# EAGLE design charger (EAGLE 7.5.0)
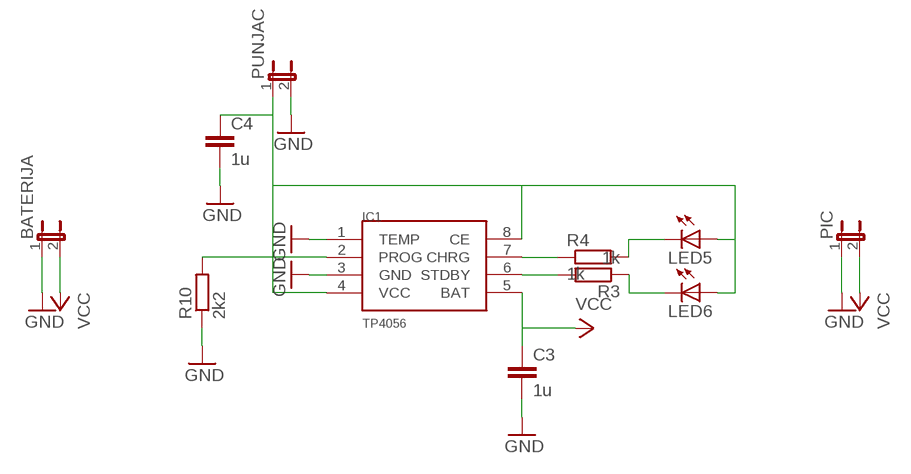
[diagram p0: schematic, sheet 1]

## Parts
BATERIJA  JP1E  [JP1]
C3  1u  C-EU050-024X044  [C050-024X044]
C4  1u  C-EU050-024X044  [C050-024X044]
IC1  TP4056  [SOP-8]
LED5  LED3MM  [LED3MM]
LED6  LED3MM  [LED3MM]
PIC  JP1E  [JP1]
PUNJAC  JP1E  [JP1]
R3  1k  R-EU_0207/10  [0207/10]
R4  1k  R-EU_0207/10  [0207/10]
R10  2k2  R-EU_0207/10  [0207/10]

## Nets
GND: BATERIJA.1 C3.2 C4.2 IC1.1(TEMP) IC1.3(GND) PIC.1 PUNJAC.2 R10.1
N$18: IC1.7(CHRG) R4.1
N$23: IC1.6(STDBY) R3.2
N$24: LED5.K(C) R4.2
N$25: LED6.K(C) R3.1
N$26: IC1.2(PROG) R10.2
N$27: C4.1 IC1.4(VCC) IC1.8(CE) LED5.A LED6.A PUNJAC.1
VCC: BATERIJA.2 C3.1 IC1.5(BAT) PIC.2

## Library data of the parts
BATERIJA PIC PUNJAC = jumper:JP1E: JUMPER
C3 C4 = rcl:C-EU: CAPACITOR, European symbol
IC1 = TP4056:TP4056
LED5 LED6 = led:LED: LED OSRAM: - CHIPLED LG R971, LG N971, LY N971, LG Q971, LY Q971, LO R971, LY R971 LH N974, LH R974 LS Q976, LO Q976, LY Q976 LO Q996 - Hyper CHIPLED LW Q18S LB Q993, LB Q99A, LB R99A - SideLED LS A670, LO A670, LY A670, LG A670, LP A670 LB A673, LV A673, LT A673, LW A673 LH A674 LY A675 LS A676, LA A676, LO A676, LY A676, LW A676 LS A679, LY A679, LG A679 - Hyper Micro SIDELED® LS Y876, LA Y876, LO Y876, LY Y876 LT Y87S - SmartLED LW L88C, LW L88S LB L89C, LB L89S, LG L890 LS L89K, LO L89K, LY L89K LS L896, LA L896, LO L896, LY L896 - TOPLED LS T670, LO T670, LY T670, LG T670, LP T670 LSG T670, LSP T670, LSY T670, LOP T670, LYG T670 LG T671, LOG T671, LSG T671 LB T673, LV T673, LT T673, LW T673 LH T674 LS T676, LA T676, LO T676, LY T676, LB T676, LH T676, LSB T676, LW T676 LB T67C, LV T67C, LT T67C, LS T67K, LO T67K, LY T67K, LW E67C LS E67B, LA E67B, LO E67B, LY E67B, LB E67C, LV E67C, LT E67C LW T67C LS T679, LY T679, LG T679 LS T770, LO T770, LY T770, LG T770, LP T770 LB T773, LV T773, LT T773, LW T773 LH T774 LS E675, LA E675, LY E675, LS T675 LS T776, LA T776, LO T776, LY T776, LB T776 LHGB T686 LT T68C, LB T68C - Hyper Mini TOPLED® LB M676 - Mini TOPLED Santana® LG M470 LS M47K, LO M47K, LY M47K Source: http://www.osram.convergy.de LUXEON: - LUMILED® LXK2-PW12-R00, LXK2-PW12-S00, LXK2-PW14-U00, LXK2-PW14-V00 LXK2-PM12-R00, LXK2-PM12-S00, LXK2-PM14-U00 LXK2-PE12-Q00, LXK2-PE12-R00, LXK2-PE12-S00, LXK2-PE14-T00, LXK2-PE14-U00 LXK2-PB12-K00, LXK2-PB12-L00, LXK2-PB12-M00, LXK2-PB14-N00, LXK2-PB14-P00, LXK2-PB14-Q00 LXK2-PR12-L00, LXK2-PR12-M00, LXK2-PR14-Q00, LXK2-PR14-R00 LXK2-PD12-Q00, LXK2-PD12-R00, LXK2-PD12-S00 LXK2-PH12-R00, LXK2-PH12-S00 LXK2-PL12-P00, LXK2-PL12-Q00, LXK2-PL12-R00 Source: www.luxeon.com KINGBRIGHT: KA-3528ASYC Source: www.kingbright.com
R3 R4 R10 = rcl:R-EU_: RESISTOR, European symbol

## Board
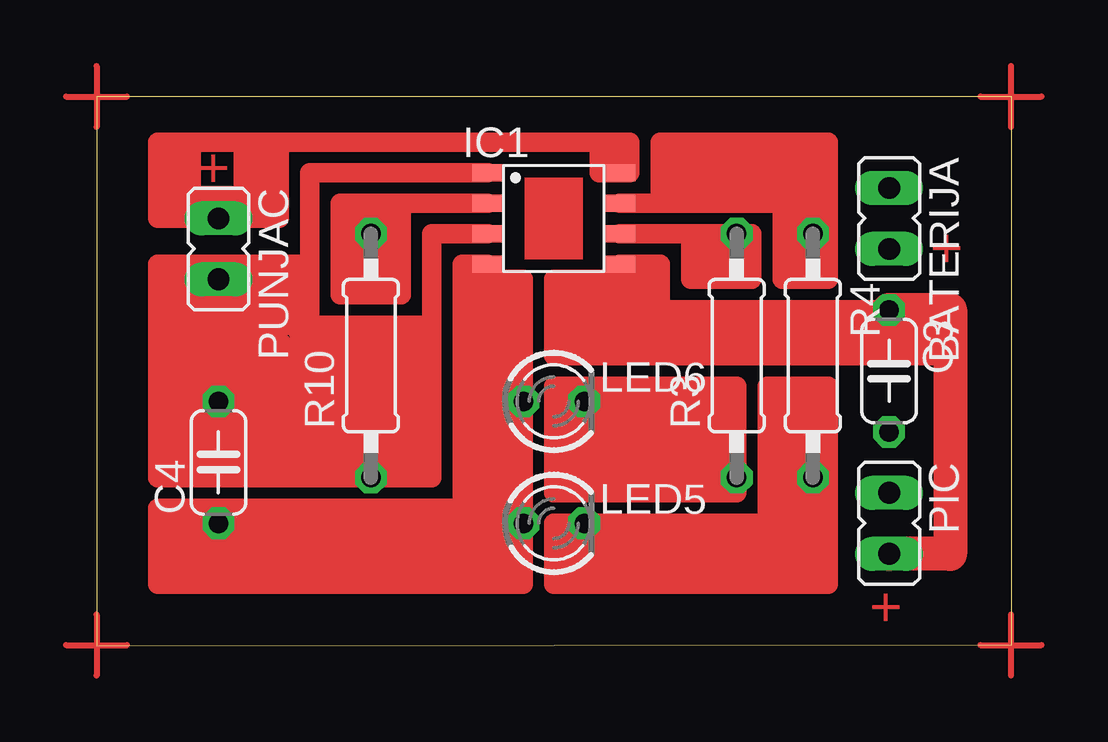
[diagram p1: board, top side]
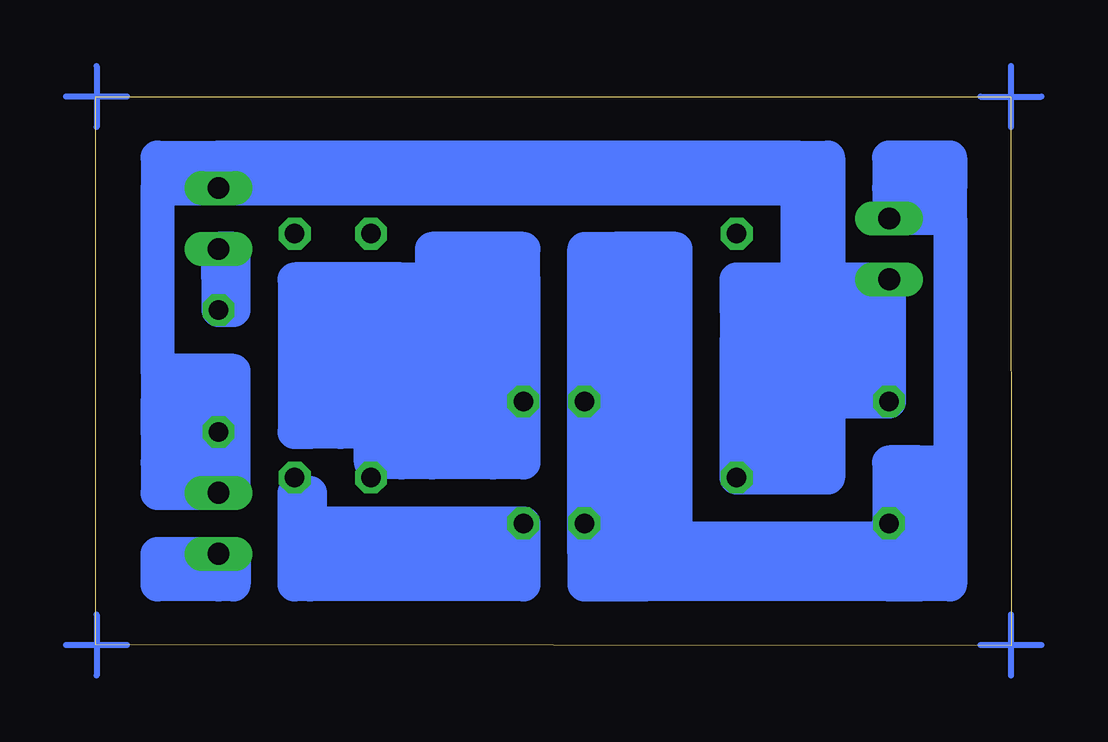
[diagram p2: board, bottom side, seen from below]

Size 38.13 x 22.88 mm. Coordinates in mm from the lower left corner, seen from the top.
Outline: 0,0 38.13,0.03 38.13,22.88 0,22.87 0,0
Copper layers (1*16): Top 0.035mm / dielectric 1.5mm / Bottom 0.035mm
Design rules "default": minimum track width 10mil, minimum drill 24mil, track to track 8mil, track to pad 8mil, pad to pad 8mil, via to via 8mil, smd to smd 8mil, copper to edge 40mil, drill to drill 8mil, minimum pad ring 10mil, minimum via ring 8mil, stop-mask expansion 4mil, vias tented up to drill 0mil, thermal gap 10mil

### Footprints (pad centres in the part's own frame; a part is rotated, then mirrored left to right if it is on the bottom)
JP1 = drill 0.914 long: 1 0,-1.27; 2 0,1.27
C050-024X044 = drill 0.813 octagon: 1 -2.54,0; 2 2.54,0
SOP-8 = smd 1.3 x 0.7: 1 -2.75,1.905; 2 -2.75,0.635; 3 -2.75,-0.635; 4 -2.75,-1.905; 5 2.75,-1.905; 6 2.75,-0.635; 7 2.75,0.635; 8 2.75,1.905
LED3MM = drill 0.813 octagon: A -1.27,0; K 1.27,0
0207/10 = drill 0.813 octagon: 1 -5.08,0; 2 5.08,0

### Placement (x,y rotation side)
BATERIJA  33.02,17.8 180 top
C3  33.02,11.45 270 top
C4  5.08,7.64 90 top
IC1  19.05,17.8 0 top
LED5  19.05,5.1 0 top
LED6  19.05,10.18 0 top
PIC  33.02,5.1 180 top
PUNJAC  5.08,16.53 180 top
R3  26.67,12.08 90 top
R4  29.85,12.08 270 top
R10  11.43,12.08 90 top

### Tracks (layer width: path | path; a pad name or v marks a point on that pad's centre or on a via)
GND
  Top 0.813: IC1.3 13.97,17.16 13.97,13.35 | IC1.1 8.89,19.7 8.89,15.89 | 8.89,15.89 3.81,15.89 | 4.45,14.62 8.89,14.62 | 8.89,14.62 8.89,15.89 | 8.89,15.89 8.26,15.26 PUNJAC.2 4.45,15.26 | 13.97,13.35 8.89,13.35 | 8.89,13.35 8.89,13.99 | 8.89,13.99 8.89,14.62 | 13.97,7.64 13.97,7 | 13.97,7 R10.1 | R10.1 5.72,7 | 5.72,7 4.45,7 | 4.45,14.62 4.45,13.99 | 4.45,7 4.45,7.64 | 4.45,7.64 5.72,7.64 | 5.72,7.64 13.34,7.64 | 13.34,7.64 13.97,7.64 | 13.97,7.64 13.97,8.27 | 13.97,8.27 13.97,12.72 | 13.97,13.35 13.97,12.72 | 13.97,12.72 8.89,12.72 8.89,13.35 | 8.89,13.99 4.45,13.99 | 4.45,7.64 13.97,8.27 | 13.97,8.27 13.34,12.08 10.16,12.08 | 8.89,12.08 8.26,13.35 5.08,13.35 5.08,12.72 | 5.08,12.72 5.08,12.08 | 5.08,11.45 C4.2 5.08,8.27 5.72,8.27 | 12.7,8.27 13.34,8.27 13.34,11.45 12.7,11.45 | 12.7,11.45 12.07,11.45 | 11.43,11.45 10.8,11.45 | 10.16,11.45 9.53,11.45 | 9.53,11.45 8.89,11.45 | 8.89,11.45 7.62,12.72 5.08,12.72 | 5.08,12.72 5.72,8.27 | 5.72,8.27 6.35,8.27 | 6.35,8.27 6.99,8.27 | 7.62,8.27 8.26,8.27 | 8.89,8.27 9.53,8.27 | 10.16,8.27 10.8,8.27 | 11.43,8.27 12.07,8.27 | 12.07,8.27 12.7,8.27 | 12.7,8.27 12.7,11.45 | 8.89,11.45 8.26,11.45 | 8.26,11.45 5.08,11.45 | 5.08,11.45 5.08,12.08 | 5.08,12.08 5.72,12.08 | 5.72,12.08 6.35,12.08 | 6.99,12.08 7.62,12.08 | 7.62,12.08 8.89,12.08 | 5.72,12.08 5.72,7.64 | 5.72,7.64 6.35,8.27 | 6.35,8.27 6.35,12.08 | 6.35,12.08 6.99,12.08 | 6.99,12.08 6.99,8.27 | 6.99,8.27 7.62,8.27 | 7.62,8.27 7.62,12.08 | 7.62,12.08 8.26,11.45 | 8.26,11.45 8.26,8.27 | 8.26,8.27 8.89,8.27 | 8.89,8.27 8.89,12.08 | 8.89,12.08 10.16,12.08 | 10.16,12.08 9.53,11.45 | 9.53,11.45 9.53,8.27 | 9.53,8.27 10.16,8.27 | 10.16,8.27 10.16,11.45 | 10.16,11.45 10.8,11.45 | 10.8,11.45 10.8,8.27
  Top 0.813: 10.8,8.27 11.43,8.27 | 11.43,8.27 11.43,11.45 | 11.43,11.45 12.07,11.45 | 12.07,11.45 12.07,8.27 | 12.07,8.27 13.34,7.64 | 13.34,7.64 13.97,7 | R10.1 11.43,8.27 | 3.81,14.62 3.81,15.89 | 3.18,15.89 2.54,15.89 2.54,7 3.18,7 | 5.72,7 5.72,7.64 | 4.45,7.64 3.81,7.64 | 3.81,7.64 3.81,14.62 | 3.81,14.62 4.45,14.62 | 4.45,13.99 4.45,7.64 | 4.45,7 3.81,7 | 3.81,7 3.18,7 | 3.18,7 3.18,15.89 | 3.18,15.89 3.81,15.89 | 3.81,7.64 3.81,7
  Bottom 1.422: 8.89,15.26 7.62,15.26 | 33.02,20.34 BATERIJA.1 | BATERIJA.1 8.89,19.07 | 8.89,20.34 33.02,20.34 | 35.56,19.07 35.56,20.34 33.02,20.34 | 35.56,19.07 BATERIJA.1 | 8.89,19.07 8.89,20.34 | 8.89,20.34 7.62,20.34 7.62,19.07 | 7.62,19.07 7.62,16.53 | 7.62,16.53 8.89,16.53 | 8.89,16.53 8.89,19.07 | 8.89,19.07 7.62,19.07 | 7.62,16.53 7.62,15.26 | 7.62,10.18 7.62,7 8.89,7 | 10.16,7 R10.1 11.43,10.18 | 11.43,11.45 11.43,12.72 | 11.43,13.99 11.43,15.26 8.89,15.26 | 8.89,15.26 8.89,16.53 | 7.62,12.72 7.62,10.18 | 7.62,10.18 C4.2 | C4.2 5.08,11.45 | 5.08,12.72 5.08,13.99 | 5.08,13.99 11.43,13.99 | 11.43,13.99 11.43,12.72 | 11.43,12.72 7.62,12.72 | 10.16,10.18 8.89,10.18 | C4.2 8.89,10.18 | 8.89,10.18 8.89,7 | 8.89,7 10.16,7 | 10.16,7 10.16,10.18 | 10.16,10.18 11.43,10.18 | 11.43,10.18 11.43,11.45 | 11.43,11.45 5.08,11.45 | 5.08,11.45 5.08,12.72 | 5.08,12.72 7.62,12.72 | 7.62,12.72 7.62,15.26 | 7.62,15.26 PUNJAC.2 5.08,13.99 | PIC.1 32.39,6.37 32.39,11.45 33.02,11.45 | 33.02,7.64 C3.2 | 34.29,8.91 35.56,8.91 | 35.56,8.91 35.56,10.18 | 35.56,11.45 35.56,19.07 | 35.56,8.91 35.56,7.64 | 35.56,7.64 35.56,6.37 PIC.1 | PIC.1 33.02,7.64 | 35.56,7.64 33.02,7.64 | 33.02,10.18 33.02,11.45 | 33.02,11.45 35.56,11.45 | 35.56,11.45 35.56,10.18 | 35.56,10.18 34.29,10.18 | 34.29,8.91 34.29,10.18 | 34.29,10.18 33.02,10.18 | 33.02,10.18 C3.2 | 34.29,8.91 C3.2
N$1
  Bottom 0.254: 0,24.15 0,21.61
N$2
  Bottom 0.254: 1.27,22.88 -1.27,22.88
N$3
  Bottom 0.254: 36.83,22.88 39.37,22.88
N$4
  Bottom 0.254: 38.1,24.15 38.1,21.61
N$5
  Bottom 0.254: 0,1.29 0,-1.25
N$6
  Bottom 0.254: -1.27,0.02 1.27,0.02
N$7
  Bottom 0.254: 38.1,1.29 38.1,-1.25
N$8
  Bottom 0.254: 36.83,0.02 39.37,0.02
N$9
  Top 0.254: 0,24.15 0,21.61
N$10
  Top 0.254: -1.27,22.88 1.27,22.88
N$11
  Top 0.254: 0,1.29 0,-1.25
N$12
  Top 0.254: -1.27,0.02 1.27,0.02
N$13
  Top 0.254: 36.83,0.02 39.37,0.02
N$14
  Top 0.254: 38.1,1.29 38.1,-1.25
N$15
  Top 0.254: 38.1,24.15 38.1,21.61
N$16
  Top 0.254: 36.83,22.88 39.37,22.88
N$18
  Top 0.813: IC1.7 23.5,18.43 | 23.5,18.43 28.58,18.43 | 28.58,18.43 28.58,15.26 30.48,15.26 30.48,15.89 | 30.48,18.43 29.21,18.43 | 29.21,18.43 29.21,15.89 29.85,15.89 | 29.21,18.43 28.58,18.43 | 23.5,18.43 23.5,19.07 | 23.5,20.34 23.5,20.97 29.85,20.97 | 29.85,20.97 30.48,20.97 30.48,18.43 | 30.48,18.43 30.48,15.89 | 30.48,15.89 29.85,15.89 | 29.85,15.89 R4.1 | R4.1 29.85,19.07 | 29.85,19.7 29.85,20.34 | 24.13,20.34 23.5,20.34 | 23.5,20.34 23.5,19.07 | 23.5,19.07 29.85,19.07 | 29.85,19.07 29.85,19.7 | 29.85,19.7 24.13,19.7 24.13,20.34 | 24.13,20.34 29.85,20.34 | 29.85,20.34 29.85,20.97 | 29.85,20.34 R4.1
N$23
  Top 0.813: IC1.6 24.77,17.16 | 25.4,15.26 27.31,15.26 27.31,17.16 R3.2 | R3.2 25.4,17.16 | 25.4,17.16 24.77,17.16 | 24.77,17.16 24.77,15.26 25.4,15.26 | 25.4,15.26 25.4,16.53 | 25.4,17.16 25.4,16.53 | 25.4,16.53 26.04,16.53 26.04,15.89 26.67,15.89 R3.2
N$24
  Top 0.813: 29.85,10.81 30.48,10.81 30.48,2.56 29.85,2.56 | 29.21,10.81 28.58,10.81 | 28.58,10.81 27.94,10.81 27.94,5.1 | 27.31,5.1 26.67,5.1 | 25.4,5.1 24.77,5.1 | 24.13,5.1 23.5,5.1 | 22.86,5.1 22.23,5.1 | 21.59,5.1 20.96,5.1 | 29.85,2.56 28.58,2.56 | 28.58,2.56 27.94,2.56 | 27.94,2.56 27.31,2.56 | 26.67,2.56 26.04,2.56 | 26.04,2.56 24.77,2.56 | 24.77,2.56 24.13,2.56 | 23.5,2.56 22.86,2.56 | 22.23,2.56 21.59,2.56 | 20.96,2.56 20.32,2.56 | 19.69,2.56 19.05,2.56 19.05,5.1 19.69,5.1 | 19.69,5.1 LED5.K | 19.69,5.1 19.69,2.56 | 19.69,2.56 20.32,2.56 | 20.32,2.56 LED5.K | LED5.K 20.96,5.1 | 20.96,5.1 20.96,2.56 | 20.96,2.56 21.59,2.56 | 21.59,2.56 21.59,5.1 | 21.59,5.1 22.23,5.1 | 22.23,5.1 22.23,2.56 | 22.23,2.56 22.86,2.56 | 22.86,2.56 22.86,5.1 | 22.86,5.1 23.5,5.1 | 23.5,5.1 23.5,2.56 | 23.5,2.56 24.13,2.56 | 24.13,2.56 24.13,5.1 | 24.13,5.1 24.77,5.1 | 24.77,5.1 24.77,3.19 | 24.77,2.56 24.77,3.19 | 24.77,3.19 25.4,3.19 25.4,5.1 | 25.4,5.1 26.04,5.1 | 26.04,2.56 26.04,5.1 | 26.04,5.1 26.67,5.1 | 26.67,5.1 26.67,4.46 | 26.67,3.83 26.67,2.56 | 26.67,2.56 27.31,2.56 | 27.31,2.56 27.31,3.19 | 27.31,4.46 27.31,5.1 | 27.31,5.1 27.94,5.1 | 27.94,5.1 27.94,3.19 | 27.94,2.56 27.94,3.19 | 27.94,3.19 28.58,3.19 | 28.58,3.19 28.58,10.81 | 28.58,2.56 28.58,3.19 | 28.58,3.19 29.21,3.19 29.21,3.83 | 29.21,7 29.21,10.81 | 29.21,10.81 29.85,10.81 | 29.85,10.81 R4.2 | R4.2 29.85,3.19 | 29.85,2.56 29.85,3.19 | 29.85,3.19 27.31,3.19 | 27.31,3.19 27.31,4.46 | 27.31,4.46 29.21,4.46 | 29.21,4.46 29.21,3.83 | 29.21,3.83 26.67,3.83 | 26.67,3.83 26.67,4.46 | 26.67,4.46 27.31,4.46 | 29.21,4.46 29.21,7 | 29.21,7 R4.2
  Bottom 1.422: 20.32,3.83 20.32,2.56 29.21,2.56 | 29.21,3.83 29.21,5.1 | 29.21,5.1 LED5.K 20.32,3.83 | 20.32,3.83 29.21,3.83 | 29.21,3.83 29.21,2.56 | 29.21,2.56 29.85,2.56 29.85,6.37 29.21,6.37 29.21,5.1
N$25
  Top 0.813: LED6.K 19.05,10.18 | 19.05,10.18 19.05,10.81 19.69,10.81 | 19.05,10.18 19.05,6.37 19.69,6.37 | 19.69,6.37 26.67,6.37 R3.1 | R3.1 26.67,10.81 19.69,10.81 | 19.69,10.81 19.69,7 | 19.69,6.37 19.69,7 | 19.69,7 20.32,7 | 20.32,7 26.04,7 26.04,7.64 | 26.04,7.64 26.04,10.18 LED6.K | LED6.K 20.32,9.54 | 20.32,9.54 20.32,8.91 | 20.32,8.91 20.32,7.64 | 20.32,7 20.32,7.64 | 20.32,7.64 20.96,7.64 | 20.96,7.64 25.4,7.64 | 26.04,7.64 25.4,7.64 | 25.4,7.64 25.4,9.54 20.96,9.54 | 20.32,9.54 20.96,9.54 | 20.96,9.54 20.96,8.27 | 20.96,7.64 20.96,8.27 | 20.96,8.27 24.77,8.27 24.77,8.91 | 20.32,8.91 24.77,8.91 | 24.77,8.91 26.67,8.91 R3.1
  Bottom 1.422: LED6.K 20.32,8.91 | 20.32,8.91 20.32,7.64 21.59,7.64 | 21.59,7.64 24.13,7.64 | 25.4,15.26 24.13,15.26 | 20.32,15.26 20.32,16.53 24.13,16.53 24.13,15.26 | 22.86,15.26 20.32,15.26 | 20.32,15.26 20.32,13.99 | 20.32,13.99 LED6.K | 21.59,8.91 20.32,8.91 | 25.4,8.91 25.4,13.99 | 20.32,13.99 21.59,13.99 | 21.59,13.99 21.59,12.72 | 21.59,12.72 21.59,8.91 | 21.59,8.91 22.86,8.91 | 25.4,8.91 24.13,8.91 | 24.13,8.91 24.13,13.99 | 24.13,13.99 22.86,13.99 | 21.59,13.99 22.86,13.99 | 22.86,13.99 22.86,12.72 | 22.86,12.72 26.67,12.72 | 26.67,12.72 26.67,11.45 | 26.67,11.45 26.67,8.91 | 25.4,7.64 26.67,7.64 26.67,8.91 | 26.67,8.91 25.4,8.91 | 25.4,8.91 25.4,7.64 | 24.13,7.64 24.13,8.91 | 24.13,8.91 22.86,8.91 | 21.59,8.91 21.59,7.64 | 24.13,7.64 25.4,7.64 | 24.13,15.26 22.86,15.26 | 22.86,15.26 22.86,13.99 | 24.13,13.99 25.4,13.99 | 25.4,13.99 25.4,15.26 | 26.67,15.26 27.94,15.26 | 27.94,15.26 29.85,15.26 29.85,8.91 29.21,8.91 | 27.94,13.99 27.94,15.26 | 25.4,15.26 26.67,15.26 | 26.67,15.26 26.67,13.99 | 21.59,12.72 22.86,12.72 | 22.86,8.91 22.86,12.72 | 26.67,12.72 27.94,12.72 | 27.94,12.72 27.94,13.99 | 27.94,13.99 26.67,13.99 | 26.67,13.99 26.67,12.72 | 26.67,11.45 20.32,11.45 LED6.K | 27.94,12.72 27.94,10.18 | 27.94,8.91 29.21,8.91 | 29.21,8.91 29.21,10.18 | 27.94,13.99 29.21,13.99 29.21,10.18 | 29.21,10.18 27.94,10.18 | 26.67,8.91 27.94,8.91 | 27.94,8.91 27.94,10.18
N$26
  Top 0.813: IC1.2 12.7,18.43 | 10.16,15.26 10.16,14.62 12.7,14.62 12.7,15.26 | 12.7,18.43 10.16,18.43 10.16,15.26 | 10.16,15.26 10.8,15.26 | 10.8,15.26 11.43,15.26 | 11.43,15.26 12.7,15.26 | 12.7,15.26 12.7,15.89 | 12.7,15.89 12.7,17.8 | 12.7,18.43 12.7,17.8 | 12.7,17.8 12.07,17.8 | 11.43,17.8 10.8,17.8 10.8,15.89 | 10.8,15.26 10.8,15.89 | 10.8,15.89 12.07,15.89 | 12.07,15.89 12.7,15.89 | 12.7,15.89 12.07,17.8 | 12.07,17.8 11.43,17.8 | 11.43,15.26 R10.2 11.43,17.8 | 11.43,15.26 12.07,15.89 | 12.07,15.89 11.43,17.8
N$27
  Top 0.813: 22.23,20.97 21.59,20.97 | 21.59,20.97 20.96,20.97 | 7.62,20.97 6.99,20.97 | 6.99,20.97 2.54,20.97 2.54,20.34 | 6.99,17.8 7.62,17.8 7.62,20.34 | 7.62,20.34 7.62,20.97 | 20.96,20.97 20.96,19.7 21.59,19.7 | 21.59,19.7 IC1.8 22.23,19.7 22.23,20.97 | 22.23,20.97 21.59,20.34 | 21.59,20.34 21.59,19.7 | 21.59,20.34 21.59,20.97 | 20.96,20.97 7.62,20.97 | 6.99,20.97 6.99,17.8 | 6.99,17.8 PUNJAC.1 3.81,17.8 | LED6.A 17.78,10.81 | 17.78,11.45 17.78,12.08 | 17.78,12.72 17.78,13.35 | 17.78,13.99 17.78,14.62 | 17.78,14.62 17.78,15.26 15.24,15.26 | LED5.A 17.78,5.73 | 17.78,6.37 17.78,7 | 17.78,7.64 17.78,8.27 | 17.78,8.91 17.78,9.54 | 15.24,15.26 15.24,15.89 IC1.4 | 15.24,15.26 15.24,14.62 | 15.24,13.99 15.24,13.35 | 15.24,12.72 15.24,12.08 | 15.24,8.91 15.24,8.27 | 15.24,7.64 15.24,7 | 15.24,6.37 15.24,5.73 | 15.24,5.1 15.24,4.46 | 15.24,4.46 17.78,4.46 LED5.A | LED5.A 16.51,5.1 | 15.88,5.1 15.24,5.1 | 16.51,5.73 17.78,5.73 | 17.78,5.73 17.78,6.37 | 17.78,6.37 15.24,6.37 | 15.24,6.37 15.24,7 | 15.24,7 17.78,7 | 17.78,7 17.78,7.64 | 17.78,7.64 15.24,7.64 | 15.24,7.64 15.24,8.27 | 15.24,8.27 17.78,8.27 | 17.78,8.27 17.78,8.91 | 17.78,8.91 15.24,8.91 | 15.24,8.91 15.24,10.18 | 15.24,10.18 15.88,10.18 | 15.88,10.18 15.88,9.54 17.78,9.54 | 17.78,9.54 LED6.A | LED6.A 15.88,10.18 | 15.24,10.18 15.24,10.81 | 15.24,10.81 17.78,10.81 | 17.78,10.81 17.78,11.45 | 17.78,11.45 15.24,11.45 | 15.24,11.45 15.24,12.08 | 15.24,12.08 17.78,12.08 | 17.78,12.08 17.78,12.72 | 17.78,12.72 15.24,12.72 | 15.24,12.72 15.24,13.35 | 15.24,13.35 17.78,13.35 | 17.78,13.35 17.78,13.99 | 17.78,13.99 15.24,13.99 | 15.24,13.99 15.24,14.62 | 15.24,14.62 15.88,14.62 | 17.78,14.62 15.88,14.62 | 15.88,14.62 15.88,5.1 | 15.88,5.1 16.51,5.1
  Top 0.813: 16.51,5.1 16.51,5.73 | 16.51,5.73 15.24,5.73 | 15.24,5.73 15.24,5.1 | 15.24,5.1 12.7,5.1 | 10.16,5.1 C4.1 | C4.1 5.08,5.73 | 10.16,5.73 10.16,5.1 | 10.16,5.1 12.7,5.1 | 12.7,5.1 12.7,5.73 | 12.7,5.73 15.24,5.73 | 15.24,10.81 15.24,11.45 | 5.08,5.73 6.99,5.73 | 6.99,5.73 10.16,5.73 | 10.16,5.73 12.7,5.73 | 5.08,2.56 6.35,2.56 | 6.99,2.56 17.78,2.56 17.78,3.19 | 17.78,3.83 LED5.A | 5.08,4.46 5.08,3.83 | 5.08,3.83 17.78,3.83 | 17.78,3.83 17.78,3.19 | 17.78,3.19 6.35,3.19 | 5.08,4.46 15.24,4.46 | 5.08,3.19 5.08,2.56 | 4.45,5.73 5.08,5.73 | 6.99,5.73 6.99,2.56 | 6.99,2.56 6.35,2.56 | 6.35,2.56 6.35,3.19 | 6.35,3.19 5.08,3.19 | 4.45,5.73 4.45,4.46 | 4.45,4.46 4.45,3.19 | 4.45,3.19 5.08,3.19 | 5.08,3.19 5.08,3.83 | 3.18,17.8 3.81,17.8 | 2.54,20.34 3.18,20.34 3.18,17.8 | 2.54,20.34 2.54,19.07 | 2.54,19.07 2.54,17.8 2.87,17.8 | 5.08,2.56 2.54,2.56 2.54,5.73 3.18,5.73 | 4.45,3.19 3.18,3.19 3.18,3.83 | 3.18,4.46 3.18,5.1 | 3.18,5.1 C4.1 | C4.1 5.08,4.46 | 5.08,3.83 3.18,3.83 | 3.18,3.83 3.18,4.46 | 4.45,4.46 3.18,4.46 | 3.18,5.1 3.18,5.73 | 3.18,5.73 4.45,5.73 | 3.95,20.97 4.57,20.97 3.49,20.97 | 3.49,20.97 2.87,20.97 2.87,17.8 | 2.87,17.8 3.18,17.8 | 3.81,17.8 3.81,18.49 | 3.81,18.49 3.81,18.14 7.21,18.14 7.21,18.15 6.75,18.15 6.75,20.89 6.97,20.89 6.97,20.34 7.62,20.34 | 3.81,18.49 3.81,18.74 6.63,18.74 | 3.49,19.04 3.44,19.04 3.44,19.07 2.54,19.07 | 3.49,20.97 3.95,20.97 | 3.95,20.97 3.95,18.83 3.78,18.83 3.78,18.69 6.11,18.69 6.11,20.77 6.26,20.77 6.26,18.89 6.39,18.89 6.39,18.61 3.47,18.61 3.47,20.68 3.5,20.68 3.5,20.34 3.81,20.34
  Bottom 1.422: 2.54,19.07 2.54,20.34 5.08,20.34 5.08,19.07 | 2.54,17.8 2.54,7.64 | 3.81,7.64 5.08,7.64 C4.1 | 5.08,2.56 3.81,2.56 | 2.54,5.1 2.54,2.56 3.81,2.56 | 3.81,3.83 3.81,7.64 | 3.81,7.64 2.54,7.64 | 2.54,7.64 2.54,5.1 | 2.54,5.1 C4.1 | 2.54,17.8 2.54,19.07 | 2.54,19.07 5.08,19.07 | 5.08,19.07 PUNJAC.1 2.54,17.8 | 5.08,3.83 5.08,4.46 | C4.1 5.08,4.46 | 5.08,4.46 13.97,4.46 13.97,16.53 15.24,16.53 | 15.24,2.56 17.78,2.56 17.78,3.83 | 5.08,2.56 5.08,3.83 | 16.51,3.83 5.08,3.83 | 5.08,3.83 3.81,3.83 | 3.81,3.83 3.81,2.56 | 5.08,2.56 15.24,2.56 | 15.24,2.56 15.24,16.53 | 15.24,16.53 16.51,16.53 | 16.51,16.53 17.78,16.53 LED5.A 17.78,3.83 | 16.51,16.53 16.51,3.83 | 16.51,3.83 17.78,3.83
VCC
  Top 0.813: IC1.5 22.86,15.89 | 23.5,13.99 23.5,15.89 22.86,15.89 | 23.5,13.99 24.13,13.99 | 24.13,13.99 32.39,13.99 | 22.86,15.89 22.86,15.26 19.05,15.26 19.05,12.08 33.02,12.08 | 32.39,12.72 31.75,12.72 | 31.75,12.72 19.69,12.72 19.69,13.35 | 19.69,13.99 19.69,14.62 22.86,14.62 22.86,13.99 | 22.86,13.99 22.86,13.35 | 22.86,13.35 19.69,13.35 | 19.69,13.35 19.69,13.99 | 19.69,13.99 22.86,13.99 | 22.86,13.99 23.5,13.99 | 24.13,13.99 24.13,13.35 | 24.13,13.35 22.86,13.35 | 24.13,13.35 31.75,13.35 | 32.39,13.35 32.39,13.99 | C3.1 32.39,13.99 | 32.39,12.72 32.39,12.08 34.93,12.08 34.93,12.72 32.39,12.72 | 31.75,12.72 31.75,13.35 | 34.93,13.35 32.39,13.35 | 31.75,13.35 32.39,13.35
  Top 1.422: C3.1 35.56,13.99 35.56,3.83 PIC.2
  Bottom 1.422: 33.02,2.56 PIC.2 | PIC.2 32.39,3.83 32.39,2.56 35.56,2.56 35.56,3.83 PIC.2 | 32.39,15.26 32.39,16.53 BATERIJA.2 | 32.39,15.26 32.39,13.99 C3.1 BATERIJA.2 | 32.39,15.26 33.02,15.26 BATERIJA.2

### Text on the board
Top: + | + | +